# Altium schematic sheet control.SchDoc
size A; SheetNumber: 4; SheetTotal: 4
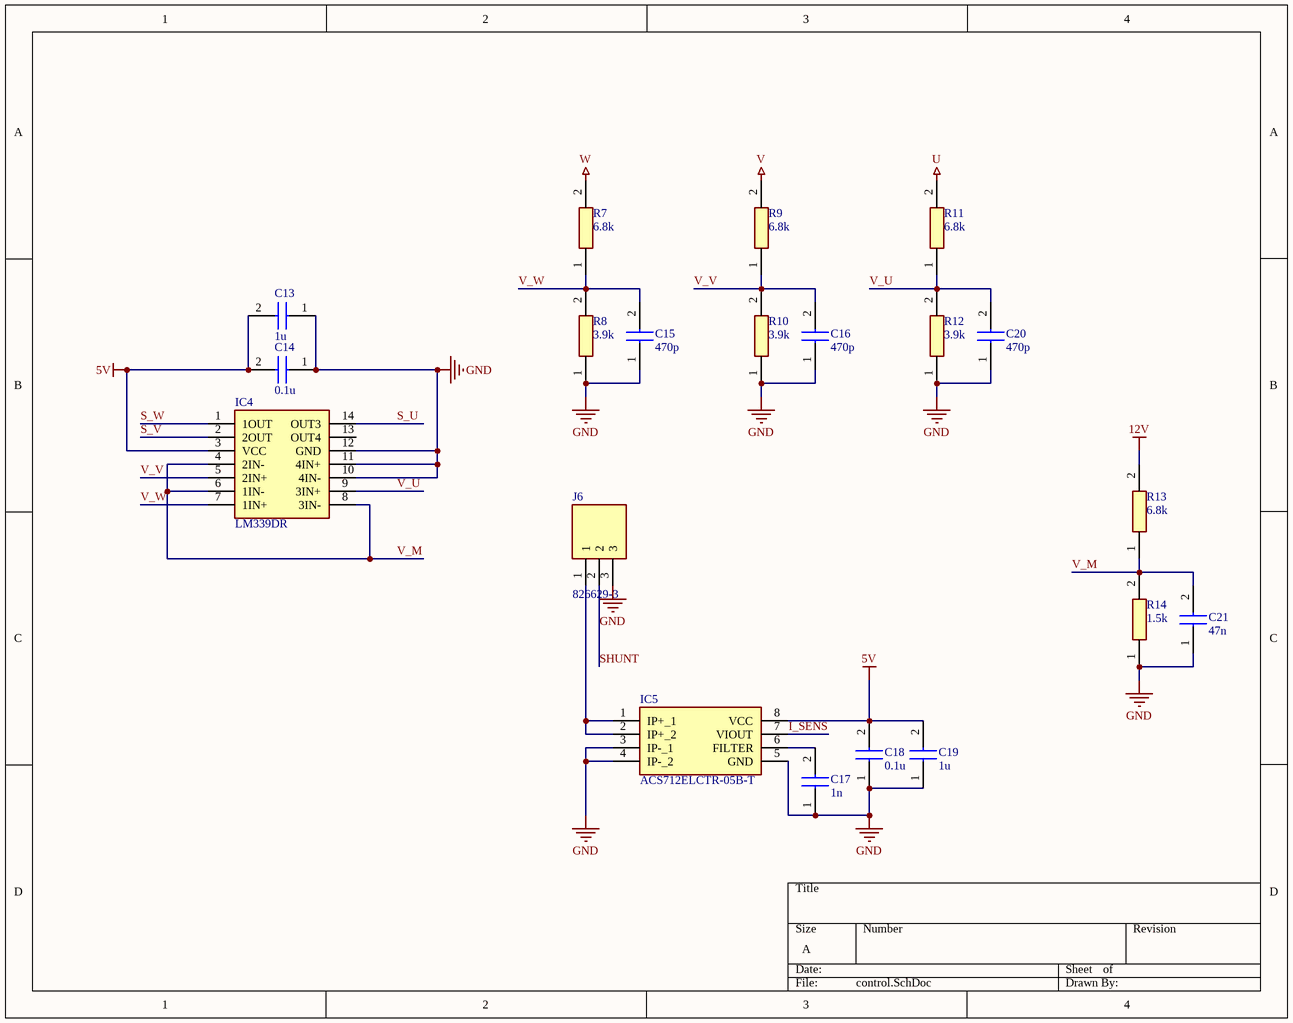
[diagram p0: control.SchDoc]

## Parts
C13  1u  [CAPC2012X145N]
C14  0.1u  [CAPC2012X95N]
C15  470p  [CAPC2012X70N]
C16  470p  [CAPC2012X70N]
C17  1n  [CAPC2012X95N]
C18  0.1u  [CAPC2012X95N]
C19  1u  [CAPC2012X145N]
C20  470p  [CAPC2012X70N]
C21  47n  [CAPC2012X70N]
IC4  LM339DR  [SOIC127P600X175-14N]
IC5  ACS712ELCTR-05B-T  [SOIC127P600X175-8N]
J6  826629-3  [HDRV3W63P0X254_1X3_762X250X950P]
R7  6.8k  [RESC2012X60N]
R8  3.9k  [RESC2012X60N]
R9  6.8k  [RESC2012X60N]
R10  3.9k  [RESC2012X60N]
R11  6.8k  [RESC2012X60N]
R12  3.9k  [RESC2012X60N]
R13  6.8k  [RESC2012X60N]
R14  1.5k  [RESC2012X60N]

## Nets
5V: C13.2 C14.2 C18.2 C19.2 IC4.3(VCC) IC5.8(VCC)
12V: R13.2
GND: C13.1 C14.1 C15.1 C16.1 C17.1 C18.1 C19.1 C20.1 C21.1 IC4.10(4IN-) IC4.11(4IN+) IC4.12(GND) IC5.3(IP-_1) IC5.4(IP-_2) IC5.5(GND) J6.3 R8.1 R10.1 R12.1 R14.1
U: R11.2
V: R9.2
W: R7.2
I_SENS: IC5.7(VIOUT)
S_U: IC4.14(OUT3)
S_V: IC4.2(2OUT)
S_W: IC4.1(1OUT)
SHUNT: J6.2
V_M: C21.2 IC4.4(2IN-) IC4.6(1IN-) IC4.8(3IN-) R13.1 R14.2
V_U: C20.2 IC4.9(3IN+) R11.1 R12.2
V_V: C16.2 IC4.5(2IN+) R9.1 R10.2
V_W: C15.2 IC4.7(1IN+) R7.1 R8.2
NetC17_2: C17.2 IC5.6(FILTER)
NetIC5_1: IC5.1(IP+_1) IC5.2(IP+_2) J6.1

Not connected (* = marked no-connect by the designer): IC4 13(OUT4)

## Library data of the parts
C13 C19 = GRM21BR71C105KA01K: Capacitor; Manufacturer_Name: Murata Electronics; Datasheet Link: http://www.murata.com/~/media/webrenewal/support/library/catalog/products/capacitor/mlcc/c02e.pdf; Height: 1.45mm; Manufacturer_Part_Number: GRM21BR71C105KA01K; Mouser Part Number: 81-GRM40X105K16K; Mouser Price/Stock: https://www.mouser.co.uk/ProductDetail/Murata-Electronics/GRM21BR71C105KA01K?qs=WNiIrCCjU2S8h%252B9o4PZIpA%3D%3D; Arrow Part Number: GRM21BR71C105KA01K; Arrow Price/Stock: https://www.arrow.com/en/products/grm21br71c105ka01k/murata-manufacturing?region=nac
C14 C17 C18 = GRM219F51H104ZA01B: Capacitor; Manufacturer_Name: Murata Electronics; Datasheet Link: http://www.murata.com/~/media/webrenewal/support/library/catalog/products/capacitor/mlcc/c02e.pdf; Height: 0.95mm; Manufacturer_Part_Number: GRM219F51H104ZA01B; Mouser Part Number: 81-GRM21F51H104ZA01B; Mouser Price/Stock: https://www.mouser.co.uk/ProductDetail/Murata-Electronics/GRM219F51H104ZA01B?qs=A13M%252BoT%252Bkzo6MjTOB8REcg%3D%3D
C15 C16 C20 C21 = GRM2165C1H471JA01D: Capacitor; Manufacturer_Name: Murata Electronics; Datasheet Link: http://www.murata.com/~/media/webrenewal/support/library/catalog/products/capacitor/mlcc/c02e.pdf; Height: 0.7mm; Manufacturer_Part_Number: GRM2165C1H471JA01D; Mouser Part Number: 81-GRM215C1H471JA01D; Mouser Price/Stock: https://www.mouser.co.uk/ProductDetail/Murata-Electronics/GRM2165C1H471JA01D?qs=kEQ31%252BHm99mGVasPXslxeg%3D%3D; Arrow Part Number: GRM2165C1H471JA01D; Arrow Price/Stock: https://www.arrow.com/en/products/grm2165c1h471ja01d/murata-manufacturing?region=nac
IC4 = LM339DR: Integrated Circuit; Manufacturer_Name: Texas Instruments; Datasheet Link: http://www.ti.com/lit/gpn/lm339; Height: 1.75mm; Manufacturer_Part_Number: LM339DR; Mouser Part Number: 595-LM339DR; Mouser Price/Stock: https://www.mouser.co.uk/ProductDetail/Texas-Instruments/LM339DR?qs=vxEfx8VrU7Aps9Hd52ppTA%3D%3D; Arrow Part Number: LM339DR; Arrow Price/Stock: https://www.arrow.com/en/products/lm339dr/texas-instruments?region=nac
IC5 = ACS712ELCTR-05B-T: Integrated Circuit; Manufacturer_Name: Allegro Microsystems; Datasheet Link: https://www.allegromicro.com/~/media/Files/Datasheets/ACS712-Datasheet.ashx; Height: 1.75mm; Manufacturer_Part_Number: ACS712ELCTR-05B-T; Mouser Part Number: 250-712ELCTR05BT; Mouser Price/Stock: https://www.mouser.co.uk/ProductDetail/Allegro-MicroSystems/ACS712ELCTR-05B-T?qs=pUKx8fyJudDs65Rkshv5ug%3D%3D; Arrow Part Number: ACS712ELCTR-05B-T; Arrow Price/Stock: https://www.arrow.com/en/products/acs712elctr-05b-t/allegro-microsystems?region=europe
J6 = 826629-3: Connector; Manufacturer_Name: TE Connectivity; Datasheet Link: http://www.te.com/commerce/DocumentDelivery/DDEController?Action=showdoc&DocId=Customer+Drawing%7F826629%7FAA%7Fpdf%7FEnglish%7FENG_CD_826629_AA_baseFilename.pdf%7F826629-3.pdf; Height: 9.5mm; Manufacturer_Part_Number: 826629-3; Mouser Part Number: 571-826629-3; Mouser Price/Stock: https://www.mouser.co.uk/ProductDetail/TE-Connectivity/826629-3?qs=AplfTeSvkkA3hKOe%252BWTzDA%3D%3D; Arrow Part Number: 826629-3; Arrow Price/Stock: https://www.arrow.com/en/products/826629-3/te-connectivity?region=europe
R7 R9 R11 R13 = RC0805FR-076K8L: Resistor; Manufacturer_Name: KEMET; Datasheet Link: http://www.yageo.com/documents/recent/PYu-RC_Group_51_RoHS_L_10.pdf; Height: 0.6mm; Manufacturer_Part_Number: RC0805FR-076K8L; Mouser Part Number: 603-RC0805FR-076K8L; Mouser Price/Stock: https://www.mouser.com/Search/Refine.aspx?Keyword=603-RC0805FR-076K8L; Arrow Part Number: RC0805FR-076K8L; Arrow Price/Stock: https://www.arrow.com/en/products/rc0805fr-076k8l/yageo
R8 R10 R12 = RC0805FR-073K9L: Resistor; Manufacturer_Name: KEMET; Datasheet Link: http://www.yageo.com/documents/recent/PYu-RC_Group_51_RoHS_L_10.pdf; Height: 0.6mm; Manufacturer_Part_Number: RC0805FR-073K9L; Mouser Part Number: 603-RC0805FR-073K9L; Mouser Price/Stock: https://www.mouser.com/Search/Refine.aspx?Keyword=603-RC0805FR-073K9L
R14 = RC0805FR-071K5L: Resistor; Manufacturer_Name: YAGEO; Datasheet Link: https://br.mouser.com/datasheet/2/447/YAGEO_PYu_RC_Group_51_RoHS_L_12-3313492.pdf; Height: 0.6mm; Manufacturer_Part_Number: RC0805FR-071K5L; Mouser Part Number: 603-RC0805FR-071K5L; Mouser Price/Stock: https://www.mouser.co.uk/ProductDetail/YAGEO/RC0805FR-071K5L?qs=8Y8p%252BasKcI6LbaohOVk4HA%3D%3D; Arrow Part Number: RC0805FR-071K5L; Arrow Price/Stock: https://www.arrow.com/en/products/rc0805fr-071k5l/yageo?region=nac